# Altium schematic sheet BootUp.SchDoc
size 420 x 297 mm; SheetNumber: 5; SheetTotal: 5
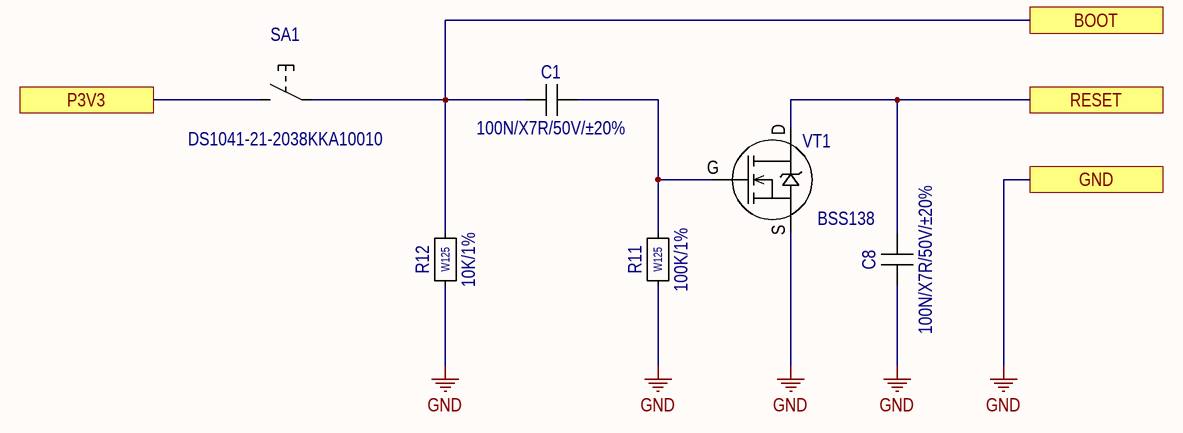
[diagram p0: BootUp.SchDoc]

## Parts
C1  value 100N/X7R/50V/±20%  [Normal_Capacitor_Standard_0805-L2000-W1250-BW500-H1350 - OVERLAY]  (hidden comment: CL21B104MBFNNNE)
C8  value 100N/X7R/50V/±20%  [Normal_Capacitor_Standard_0805-L2000-W1250-BW500-H1350 - OVERLAY]  (hidden comment: CL21B104MBFNNNE)
R11  value 100K/1%  [CHIPRESISTOR-0805-L2000-W1250-B350-H550-Overlay-L4000-W2000]  (hidden comment: RC2012(0805))
R12  value 10K/1%  [CHIPRESISTOR-0805-L2000-W1250-B350-H550-Overlay-L4000-W2000]  (hidden comment: RC2012(0805))
SA1  DS1041-21-2038KKA10010  [DS1041-21-2038KKA10010]
VT1  BSS138  [3-SOT23 - OVERLAY]

## Ports
BOOT, GND, P3V3, RESET

## Nets
GND: C8.1 R11.1 R12.1 VT1.S ; port GND
BOOT: C1.1 R12.2 SA1.1 ; port BOOT
P3V3: SA1.2 ; port P3V3
RESET: C8.2 VT1.D ; port RESET
NetC1_2: C1.2 R11.2 VT1.G

## Notes on the sheet
- Ревизия
- Дата
- Проект
- Изм.
- Лист
- № докум.
- Стр.
- Подп.
- (in symbol RC2012(0805)) W125

## Library data of the parts
C1 C8 = CL21B104MBFNNNE: Ceramic Capacitor SMD 0805; Manufacturer: SAMSUNG ELECTRO-MECHANICS
R11 R12 = RC2012(0805): Samsung Chip Resistors General Standard 0805; Manufacturer: SAMSUNG ELECTRO-MECHANICS
SA1 = DS1041-21-2038KKA10010: 6.1x6.1mm Tact Switch R/A 2 Position Type; Manufacturer: CONNFLY ELECTRONIC CO.,LTD.
VT1 = BSS138: pin to pad: D>3 G>1 S>2